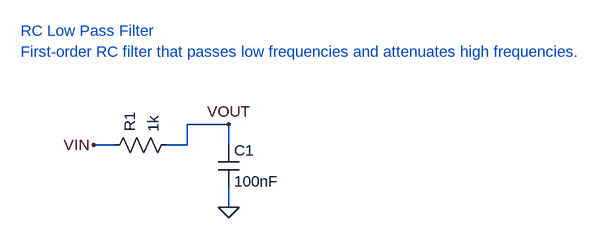
[diagram p0: schematic rc_low_pass_filter.asc]
rc_low_pass_filter.asc, the LTspice schematic file:
Version 4
SHEET 1 1200 800
TEXT 16 16 Left 2 ;RC Low Pass Filter
TEXT 16 48 Left 2 ;First-order RC filter that passes low frequencies and attenuates high frequencies.
SYMBOL res 144 208 R270
SYMATTR InstName R1
SYMATTR Value 1k
SYMBOL cap 320 192 R0
SYMATTR InstName C1
SYMATTR Value 100nF
FLAG 128 192 VIN
WIRE 128 192 160 192
FLAG 336 160 VOUT
WIRE 240 192 272 192
WIRE 272 160 272 192
WIRE 272 160 336 160
WIRE 336 160 336 192
FLAG 336 288 0
WIRE 336 256 336 288

The netlist it stands for:
* rc_low_pass_filter.asc
R1 VIN VOUT 1k
C1 VOUT 0 100nF
* RC Low Pass Filter
* First-order RC filter that passes low frequencies and attenuates high frequencies.
.backanno
.end